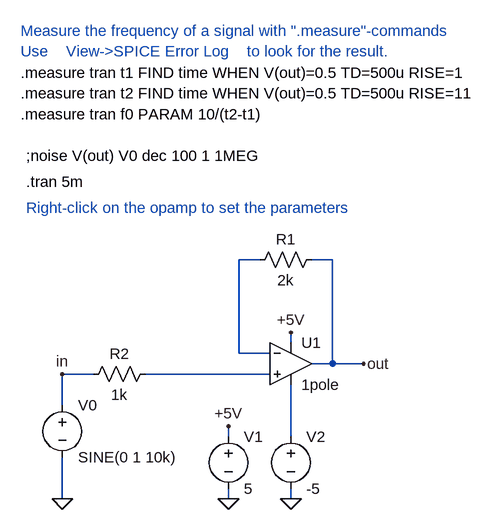
[diagram p0: schematic tran_meas_freq.asc]
tran_meas_freq.asc, the LTspice schematic file:
Version 4
SHEET 1 1180 680
WIRE -240 256 -240 208
WIRE -240 400 -240 336
WIRE -192 208 -240 208
WIRE 16 304 16 288
WIRE 16 400 16 384
WIRE 32 176 32 32
WIRE 64 32 32 32
WIRE 80 176 32 176
WIRE 80 208 -112 208
WIRE 112 160 112 144
WIRE 112 304 112 224
WIRE 112 400 112 384
WIRE 176 32 144 32
WIRE 176 192 144 192
WIRE 176 192 176 32
WIRE 224 192 176 192
FLAG -240 400 0
FLAG 16 400 0
FLAG 112 400 0
FLAG 16 288 +5V
FLAG 112 144 +5V
FLAG 224 192 out
FLAG -240 208 in
SYMBOL Opamps\\1pole 112 192 R0
SYMATTR InstName U1
SYMATTR SpiceLine2 en=10n enk=0 in=1p ink=0  Rin=500Meg
SYMBOL res 48 48 R270
WINDOW 0 32 56 VTop 0
WINDOW 3 0 56 VBottom 0
SYMATTR InstName R1
SYMATTR Value 2k
SYMBOL res -208 224 R270
WINDOW 0 32 56 VTop 0
WINDOW 3 0 56 VBottom 0
SYMATTR InstName R2
SYMATTR Value 1k
SYMBOL voltage 16 288 R0
SYMATTR InstName V1
SYMATTR Value 5
SYMBOL voltage 112 288 R0
SYMATTR InstName V2
SYMATTR Value -5
SYMBOL voltage -240 240 R0
WINDOW 123 0 0 Left 0
WINDOW 39 0 0 Left 0
SYMATTR InstName V0
SYMATTR Value SINE(0 1 10k)
TEXT -296 -128 Left 0 !;noise V(out) V0 dec 100 1 1MEG
TEXT -296 -48 Left 0 ;Right-click on the opamp to set the parameters
TEXT -296 -88 Left 0 !.tran 5m
TEXT -304 -256 Left 0 !.measure tran t1 FIND time WHEN V(out)=0.5 TD=500u RISE=1
TEXT -304 -224 Left 0 !.measure tran t2 FIND time WHEN V(out)=0.5 TD=500u RISE=11
TEXT -304 -192 Left 0 !.measure tran f0 PARAM 10/(t2-t1)
TEXT -304 -320 Left 0 ;Measure the frequency of a signal with ".measure"-commands\nUse    View->SPICE Error Log    to look for the result.

The netlist it stands for:
* tran_meas_freq.asc
* U1: 1pole en=10n enk=0 in=1p ink=0  Rin=500Meg (symbol Opamps\1pole not available, pins judged from their places): In+=N002 In-=N001 V+=+5V V-=N003 OUT=out
R1 N001 out 2k
R2 in N002 1k
V1 +5V 0 5
V2 N003 0 -5
V0 in 0 SINE(0 1 10k)
;noise V(out) V0 dec 100 1 1MEG
* Right-click on the opamp to set the parameters
.tran 5m
.measure tran t1 FIND time WHEN V(out)=0.5 TD=500u RISE=1
.measure tran t2 FIND time WHEN V(out)=0.5 TD=500u RISE=11
.measure tran f0 PARAM 10/(t2-t1)
* Measure the frequency of a signal with ".measure"-commands
* Use    View->SPICE Error Log    to look for the result.
.backanno
.end